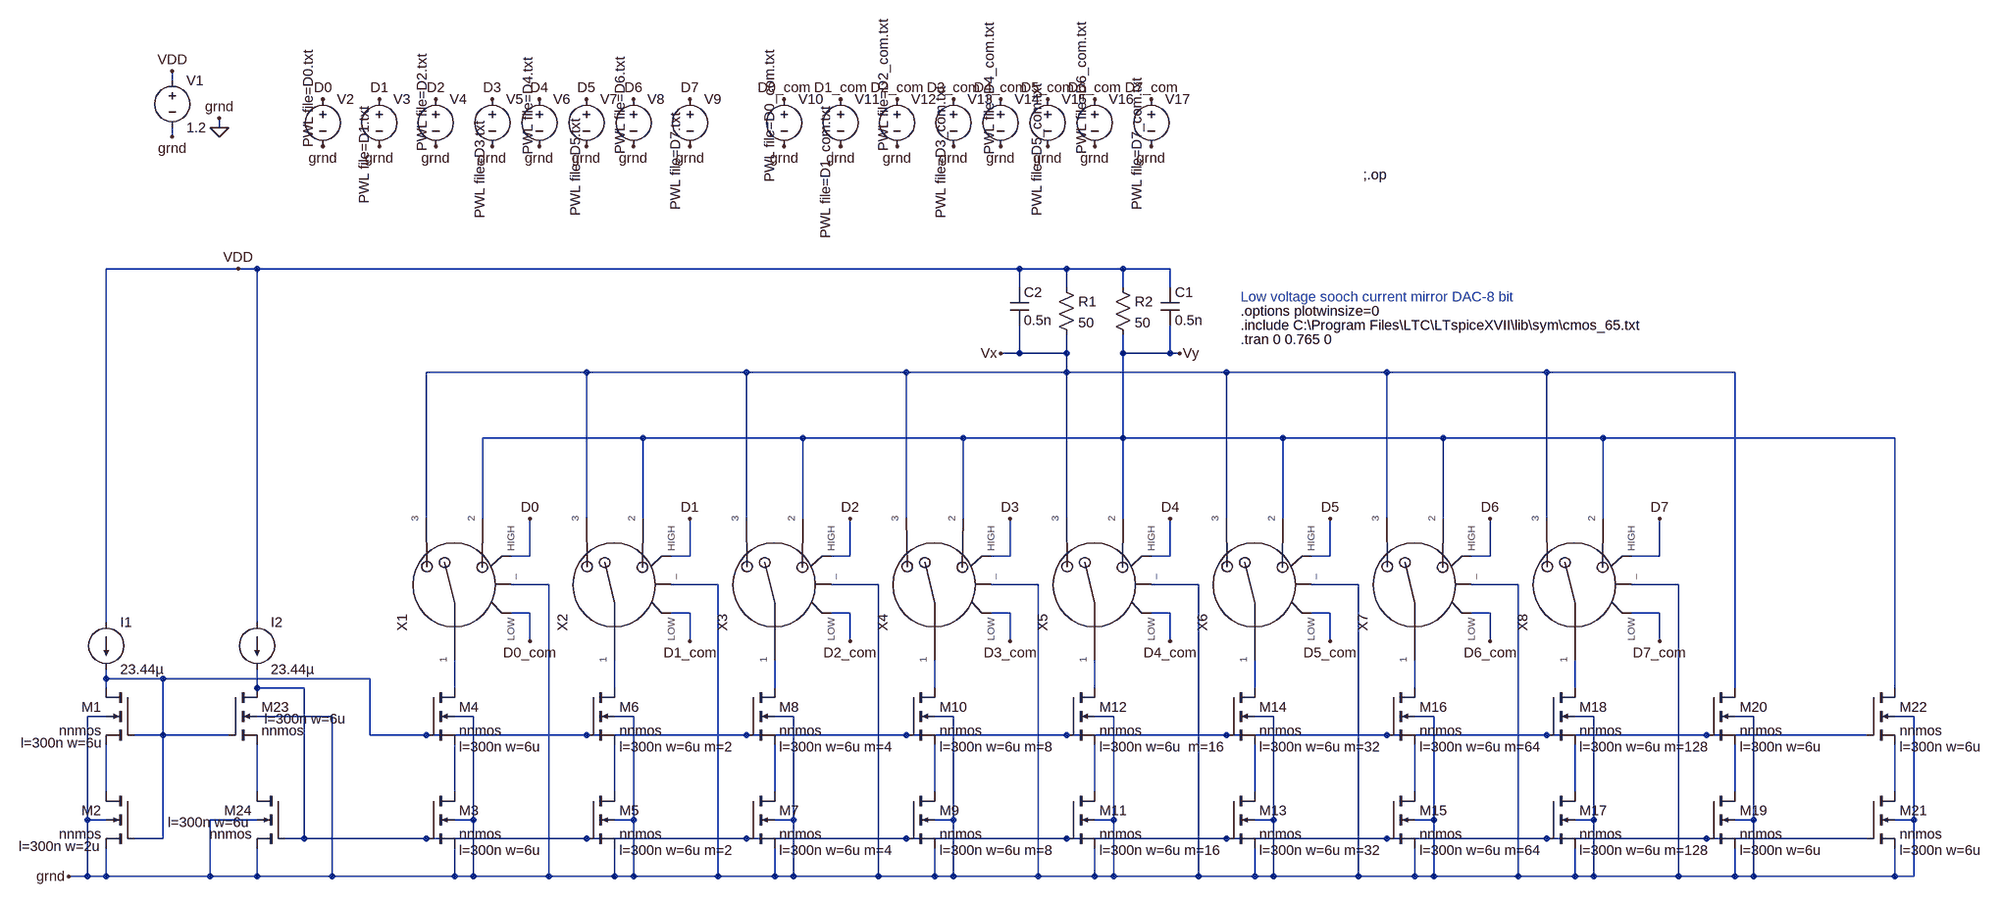
[diagram p0: schematic DAC_lvs.asc]
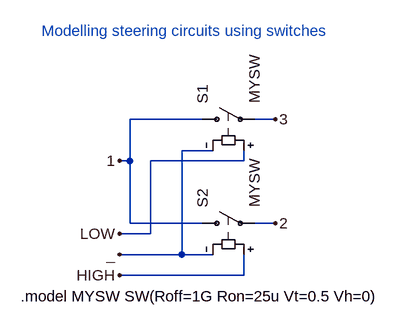
[diagram p1: sub-circuit myspdt.asc]
DAC_lvs.asc, the LTspice schematic file:
Version 4
SHEET 1 1984 1152
WIRE -1680 -336 -1680 -352
WIRE -1600 -256 -1600 -272
WIRE -1680 -240 -1680 -256
WIRE -1568 -16 -1792 -16
WIRE -1536 -16 -1568 -16
WIRE -240 -16 -1536 -16
WIRE -160 -16 -240 -16
WIRE -64 -16 -160 -16
WIRE 16 -16 -64 -16
WIRE -240 16 -240 -16
WIRE -160 16 -160 -16
WIRE -64 16 -64 -16
WIRE 16 16 16 -16
WIRE -240 128 -240 80
WIRE -240 128 -272 128
WIRE -160 128 -160 96
WIRE -160 128 -240 128
WIRE -64 128 -64 96
WIRE 16 128 16 80
WIRE 16 128 -64 128
WIRE 32 128 16 128
WIRE -976 160 -1248 160
WIRE -704 160 -976 160
WIRE -432 160 -704 160
WIRE -160 160 -160 128
WIRE -160 160 -432 160
WIRE 112 160 -160 160
WIRE 384 160 112 160
WIRE 656 160 384 160
WIRE 976 160 656 160
WIRE -880 272 -1152 272
WIRE -608 272 -880 272
WIRE -336 272 -608 272
WIRE -64 272 -64 128
WIRE -64 272 -336 272
WIRE 208 272 -64 272
WIRE 480 272 208 272
WIRE 752 272 480 272
WIRE 1248 272 752 272
WIRE -1248 464 -1248 160
WIRE -1152 464 -1152 272
WIRE -976 464 -976 160
WIRE -880 464 -880 272
WIRE -704 464 -704 160
WIRE -608 464 -608 272
WIRE -432 464 -432 160
WIRE -336 464 -336 272
WIRE -160 464 -160 160
WIRE -64 464 -64 272
WIRE 112 464 112 160
WIRE 208 464 208 272
WIRE 384 464 384 160
WIRE 480 464 480 272
WIRE 656 464 656 160
WIRE 752 464 752 272
WIRE -1072 528 -1072 464
WIRE -1072 528 -1104 528
WIRE -800 528 -800 464
WIRE -800 528 -832 528
WIRE -528 528 -528 464
WIRE -528 528 -560 528
WIRE -256 528 -256 464
WIRE -256 528 -288 528
WIRE 16 528 16 464
WIRE 16 528 -16 528
WIRE 288 528 288 464
WIRE 288 528 256 528
WIRE 560 528 560 464
WIRE 560 528 528 528
WIRE 848 528 848 464
WIRE 848 528 800 528
WIRE -1040 576 -1104 576
WIRE -752 576 -832 576
WIRE -480 576 -560 576
WIRE -208 576 -288 576
WIRE 64 576 -16 576
WIRE 336 576 256 576
WIRE 608 576 528 576
WIRE 880 576 800 576
WIRE -1072 624 -1104 624
WIRE -800 624 -832 624
WIRE -528 624 -560 624
WIRE -256 624 -288 624
WIRE 16 624 -16 624
WIRE 288 624 256 624
WIRE 560 624 528 624
WIRE 848 624 800 624
WIRE -1792 640 -1792 -16
WIRE -1536 640 -1536 -16
WIRE -1072 672 -1072 624
WIRE -800 672 -800 624
WIRE -528 672 -528 624
WIRE -256 672 -256 624
WIRE 16 672 16 624
WIRE 288 672 288 624
WIRE 560 672 560 624
WIRE 848 672 848 624
WIRE -1792 736 -1792 720
WIRE -1696 736 -1792 736
WIRE -1344 736 -1696 736
WIRE -1792 752 -1792 736
WIRE -1536 752 -1536 720
WIRE -1456 752 -1536 752
WIRE -1200 752 -1200 704
WIRE -928 752 -928 704
WIRE -656 752 -656 704
WIRE -384 752 -384 704
WIRE -112 752 -112 704
WIRE 160 752 160 704
WIRE 432 752 432 704
WIRE 704 752 704 704
WIRE 976 752 976 160
WIRE 1248 752 1248 272
WIRE -1792 800 -1824 800
WIRE -1408 800 -1536 800
WIRE -1168 800 -1200 800
WIRE -896 800 -928 800
WIRE -624 800 -656 800
WIRE -352 800 -384 800
WIRE -80 800 -112 800
WIRE 192 800 160 800
WIRE 464 800 432 800
WIRE 736 800 704 800
WIRE 1008 800 976 800
WIRE 1280 800 1248 800
WIRE -1696 832 -1696 736
WIRE -1696 832 -1744 832
WIRE -1584 832 -1696 832
WIRE -1344 832 -1344 736
WIRE -1248 832 -1344 832
WIRE -976 832 -1248 832
WIRE -704 832 -976 832
WIRE -432 832 -704 832
WIRE -160 832 -432 832
WIRE 112 832 -160 832
WIRE 384 832 112 832
WIRE 656 832 384 832
WIRE 928 832 656 832
WIRE 1200 832 928 832
WIRE -1792 928 -1792 848
WIRE -1536 928 -1536 848
WIRE -1200 928 -1200 848
WIRE -928 928 -928 848
WIRE -656 928 -656 848
WIRE -384 928 -384 848
WIRE -112 928 -112 848
WIRE 160 928 160 848
WIRE 432 928 432 848
WIRE 704 928 704 848
WIRE 976 928 976 848
WIRE 1248 928 1248 848
WIRE -1824 976 -1824 800
WIRE -1792 976 -1824 976
WIRE -1536 976 -1616 976
WIRE -1168 976 -1168 800
WIRE -1168 976 -1200 976
WIRE -896 976 -896 800
WIRE -896 976 -928 976
WIRE -624 976 -624 800
WIRE -624 976 -656 976
WIRE -352 976 -352 800
WIRE -352 976 -384 976
WIRE -80 976 -80 800
WIRE -80 976 -112 976
WIRE 192 976 192 800
WIRE 192 976 160 976
WIRE 464 976 464 800
WIRE 464 976 432 976
WIRE 736 976 736 800
WIRE 736 976 704 976
WIRE 1008 976 1008 800
WIRE 1008 976 976 976
WIRE 1280 976 1280 800
WIRE 1280 976 1248 976
WIRE -1696 1008 -1696 832
WIRE -1696 1008 -1744 1008
WIRE -1456 1008 -1456 752
WIRE -1456 1008 -1488 1008
WIRE -1248 1008 -1456 1008
WIRE -976 1008 -1248 1008
WIRE -704 1008 -976 1008
WIRE -432 1008 -704 1008
WIRE -160 1008 -432 1008
WIRE 112 1008 -160 1008
WIRE 384 1008 112 1008
WIRE 656 1008 384 1008
WIRE 928 1008 656 1008
WIRE 1200 1008 928 1008
WIRE -1824 1072 -1824 976
WIRE -1824 1072 -1856 1072
WIRE -1792 1072 -1792 1024
WIRE -1792 1072 -1824 1072
WIRE -1616 1072 -1616 976
WIRE -1616 1072 -1792 1072
WIRE -1536 1072 -1536 1024
WIRE -1536 1072 -1616 1072
WIRE -1408 1072 -1408 800
WIRE -1408 1072 -1536 1072
WIRE -1200 1072 -1200 1024
WIRE -1200 1072 -1408 1072
WIRE -1168 1072 -1168 976
WIRE -1168 1072 -1200 1072
WIRE -1040 1072 -1040 576
WIRE -1040 1072 -1168 1072
WIRE -928 1072 -928 1024
WIRE -928 1072 -1040 1072
WIRE -896 1072 -896 976
WIRE -896 1072 -928 1072
WIRE -752 1072 -752 576
WIRE -752 1072 -896 1072
WIRE -656 1072 -656 1024
WIRE -656 1072 -752 1072
WIRE -624 1072 -624 976
WIRE -624 1072 -656 1072
WIRE -480 1072 -480 576
WIRE -480 1072 -624 1072
WIRE -384 1072 -384 1024
WIRE -384 1072 -480 1072
WIRE -352 1072 -352 976
WIRE -352 1072 -384 1072
WIRE -208 1072 -208 576
WIRE -208 1072 -352 1072
WIRE -112 1072 -112 1024
WIRE -112 1072 -208 1072
WIRE -80 1072 -80 976
WIRE -80 1072 -112 1072
WIRE 64 1072 64 576
WIRE 64 1072 -80 1072
WIRE 160 1072 160 1024
WIRE 160 1072 64 1072
WIRE 192 1072 192 976
WIRE 192 1072 160 1072
WIRE 336 1072 336 576
WIRE 336 1072 192 1072
WIRE 432 1072 432 1024
WIRE 432 1072 336 1072
WIRE 464 1072 464 976
WIRE 464 1072 432 1072
WIRE 608 1072 608 576
WIRE 608 1072 464 1072
WIRE 704 1072 704 1024
WIRE 704 1072 608 1072
WIRE 736 1072 736 976
WIRE 736 1072 704 1072
WIRE 880 1072 880 576
WIRE 880 1072 736 1072
WIRE 976 1072 976 1024
WIRE 976 1072 880 1072
WIRE 1008 1072 1008 976
WIRE 1008 1072 976 1072
WIRE 1248 1072 1248 1024
WIRE 1248 1072 1008 1072
WIRE 1280 1072 1280 976
WIRE 1280 1072 1248 1072
FLAG -1600 -256 0
FLAG -1600 -272 grnd
FLAG -1680 -240 grnd
FLAG -1680 -352 VDD
FLAG -1568 -16 VDD
FLAG -272 128 Vx
FLAG 32 128 Vy
FLAG -1856 1072 grnd
FLAG -1424 -224 grnd
FLAG -1328 -224 grnd
FLAG -1232 -224 grnd
FLAG -1136 -224 grnd
FLAG -1056 -224 grnd
FLAG -976 -224 grnd
FLAG -896 -224 grnd
FLAG -800 -224 grnd
FLAG -1424 -304 D0
FLAG -1328 -304 D1
FLAG -1232 -304 D2
FLAG -1136 -304 D3
FLAG -1056 -304 D4
FLAG -976 -304 D5
FLAG -896 -304 D6
FLAG -800 -304 D7
FLAG -640 -224 grnd
FLAG -544 -224 grnd
FLAG -448 -224 grnd
FLAG -352 -224 grnd
FLAG -272 -224 grnd
FLAG -192 -224 grnd
FLAG -112 -224 grnd
FLAG -16 -224 grnd
FLAG -640 -304 D0_com
FLAG -544 -304 D1_com
FLAG -448 -304 D2_com
FLAG -352 -304 D3_com
FLAG -272 -304 D4_com
FLAG -192 -304 D5_com
FLAG -112 -304 D6_com
FLAG -1072 464 D0
FLAG -800 464 D1
FLAG -528 464 D2
FLAG -256 464 D3
FLAG 288 464 D5
FLAG 16 464 D4
FLAG 560 464 D6
FLAG 848 464 D7
FLAG -1072 672 D0_com
FLAG -800 672 D1_com
FLAG -528 672 D2_com
FLAG -256 672 D3_com
FLAG 16 672 D4_com
FLAG 288 672 D5_com
FLAG 560 672 D6_com
FLAG -16 -304 D7_com
FLAG 848 672 D7_com
DATAFLAG -1200 736 ""
DATAFLAG -1200 896 ""
DATAFLAG -928 864 ""
DATAFLAG -656 880 ""
SYMBOL nmos4 -1248 928 R0
WINDOW 123 56 100 Left 2
SYMATTR Value2 l=300n w=6u
SYMATTR InstName M3
SYMATTR Value nnmos
SYMBOL nmos4 -1248 752 R0
WINDOW 123 56 100 Left 2
SYMATTR Value2 l=300n w=6u
SYMATTR InstName M4
SYMATTR Value nnmos
SYMBOL voltage -1680 -352 R0
WINDOW 123 0 0 Left 0
WINDOW 39 0 0 Left 0
SYMATTR InstName V1
SYMATTR Value 1.2
SYMBOL nmos4 -976 928 R0
WINDOW 123 56 100 Left 2
SYMATTR Value2 l=300n w=6u m=2
SYMATTR InstName M5
SYMATTR Value nnmos
SYMBOL nmos4 -976 752 R0
WINDOW 123 56 100 Left 2
SYMATTR Value2 l=300n w=6u m=2
SYMATTR InstName M6
SYMATTR Value nnmos
SYMBOL nmos4 -704 928 R0
WINDOW 123 56 100 Left 2
SYMATTR Value2 l=300n w=6u m=4
SYMATTR InstName M7
SYMATTR Value nnmos
SYMBOL nmos4 -704 752 R0
WINDOW 123 56 100 Left 2
SYMATTR Value2 l=300n w=6u m=4
SYMATTR InstName M8
SYMATTR Value nnmos
SYMBOL nmos4 -432 928 R0
WINDOW 123 56 100 Left 2
SYMATTR Value2 l=300n w=6u m=8
SYMATTR InstName M9
SYMATTR Value nnmos
SYMBOL nmos4 -432 752 R0
WINDOW 123 56 100 Left 2
SYMATTR Value2 l=300n w=6u m=8
SYMATTR InstName M10
SYMATTR Value nnmos
SYMBOL nmos4 -160 928 R0
WINDOW 123 56 100 Left 2
SYMATTR Value2 l=300n w=6u m=16
SYMATTR InstName M11
SYMATTR Value nnmos
SYMBOL nmos4 -160 752 R0
WINDOW 123 56 100 Left 2
SYMATTR Value2 l=300n w=6u  m=16
SYMATTR InstName M12
SYMATTR Value nnmos
SYMBOL nmos4 112 928 R0
WINDOW 123 56 100 Left 2
SYMATTR Value2 l=300n w=6u m=32
SYMATTR InstName M13
SYMATTR Value nnmos
SYMBOL nmos4 112 752 R0
WINDOW 123 56 100 Left 2
SYMATTR Value2 l=300n w=6u m=32
SYMATTR InstName M14
SYMATTR Value nnmos
SYMBOL nmos4 384 928 R0
WINDOW 123 56 100 Left 2
SYMATTR Value2 l=300n w=6u m=64
SYMATTR InstName M15
SYMATTR Value nnmos
SYMBOL nmos4 384 752 R0
WINDOW 123 56 100 Left 2
SYMATTR Value2 l=300n w=6u m=64
SYMATTR InstName M16
SYMATTR Value nnmos
SYMBOL nmos4 656 928 R0
WINDOW 123 56 100 Left 2
SYMATTR Value2 l=300n w=6u m=128
SYMATTR InstName M17
SYMATTR Value nnmos
SYMBOL nmos4 656 752 R0
WINDOW 123 56 100 Left 2
SYMATTR Value2 l=300n w=6u m=128
SYMATTR InstName M18
SYMATTR Value nnmos
SYMBOL nmos4 928 928 R0
WINDOW 123 56 100 Left 2
SYMATTR Value2 l=300n w=6u
SYMATTR InstName M19
SYMATTR Value nnmos
SYMBOL nmos4 928 752 R0
WINDOW 123 56 100 Left 2
SYMATTR Value2 l=300n w=6u
SYMATTR InstName M20
SYMATTR Value nnmos
SYMBOL nmos4 1200 928 R0
WINDOW 123 56 100 Left 2
SYMATTR Value2 l=300n w=6u
SYMATTR InstName M21
SYMATTR Value nnmos
SYMBOL nmos4 1200 752 R0
WINDOW 123 56 100 Left 2
SYMATTR Value2 l=300n w=6u
SYMATTR InstName M22
SYMATTR Value nnmos
SYMBOL myspdt -1200 608 R270
SYMATTR InstName X1
SYMBOL myspdt -928 608 R270
SYMATTR InstName X2
SYMBOL myspdt -656 608 R270
SYMATTR InstName X3
SYMBOL myspdt -384 608 R270
SYMATTR InstName X4
SYMBOL myspdt -112 608 R270
SYMATTR InstName X5
SYMBOL myspdt 160 608 R270
SYMATTR InstName X6
SYMBOL myspdt 432 608 R270
SYMATTR InstName X7
SYMBOL myspdt 704 608 R270
SYMATTR InstName X8
SYMBOL res -176 0 R0
SYMATTR InstName R1
SYMATTR Value 50
SYMBOL res -80 0 R0
SYMATTR InstName R2
SYMATTR Value 50
SYMBOL nmos4 -1744 752 M0
WINDOW 123 55 93 Left 2
SYMATTR Value2 l=300n w=6u
SYMATTR InstName M1
SYMATTR Value nnmos
SYMBOL nmos4 -1744 928 M0
WINDOW 123 58 93 Left 2
SYMATTR Value2 l=300n w=2u
SYMATTR InstName M2
SYMATTR Value nnmos
SYMBOL nmos4 -1584 752 R0
WINDOW 123 61 52 Left 2
SYMATTR Value2 l=300n w=6u
SYMATTR InstName M23
SYMATTR Value nnmos
SYMBOL nmos4 -1488 928 M0
WINDOW 123 61 52 Left 2
SYMATTR Value2 l=300n w=6u
SYMATTR InstName M24
SYMATTR Value nnmos
SYMBOL current -1792 640 R0
WINDOW 123 0 0 Left 0
WINDOW 39 0 0 Left 0
SYMATTR InstName I1
SYMATTR Value 23.44µ
SYMBOL current -1536 640 R0
WINDOW 123 0 0 Left 0
WINDOW 39 0 0 Left 0
SYMATTR InstName I2
SYMATTR Value 23.44µ
SYMBOL voltage -1424 -320 R0
WINDOW 3 -24 -68 VRight 2
WINDOW 123 0 0 Left 0
WINDOW 39 0 0 Left 0
SYMATTR Value PWL file=D0.txt
SYMATTR InstName V2
SYMBOL voltage -1328 -320 R0
WINDOW 3 -25 28 VRight 2
WINDOW 123 0 0 Left 0
WINDOW 39 0 0 Left 0
SYMATTR Value PWL file=D1.txt
SYMATTR InstName V3
SYMBOL voltage -1232 -320 R0
WINDOW 3 -23 105 VLeft 2
WINDOW 123 0 0 Left 0
WINDOW 39 0 0 Left 0
SYMATTR Value PWL file=D2.txt
SYMATTR InstName V4
SYMBOL voltage -1136 -320 R0
WINDOW 3 -21 219 VLeft 2
WINDOW 123 0 0 Left 0
WINDOW 39 0 0 Left 0
SYMATTR Value PWL file=D3.txt
SYMATTR InstName V5
SYMBOL voltage -1056 -320 R0
WINDOW 3 -19 111 VLeft 2
WINDOW 123 0 0 Left 0
WINDOW 39 0 0 Left 0
SYMATTR Value PWL file=D4.txt
SYMATTR InstName V6
SYMBOL voltage -976 -320 R0
WINDOW 3 -18 215 VLeft 2
WINDOW 123 0 0 Left 0
WINDOW 39 0 0 Left 0
SYMATTR Value PWL file=D5.txt
SYMATTR InstName V7
SYMBOL voltage -896 -320 R0
WINDOW 3 -22 110 VLeft 2
WINDOW 123 0 0 Left 0
WINDOW 39 0 0 Left 0
SYMATTR Value PWL file=D6.txt
SYMATTR InstName V8
SYMBOL voltage -800 -320 R0
WINDOW 3 -24 205 VLeft 2
WINDOW 123 0 0 Left 0
WINDOW 39 0 0 Left 0
SYMATTR Value PWL file=D7.txt
SYMATTR InstName V9
SYMBOL voltage -640 -320 R0
WINDOW 3 -24 -68 VRight 2
WINDOW 123 0 0 Left 0
WINDOW 39 0 0 Left 0
SYMATTR Value PWL file=D0_com.txt
SYMATTR InstName V10
SYMBOL voltage -544 -320 R0
WINDOW 3 -25 28 VRight 2
WINDOW 123 0 0 Left 0
WINDOW 39 0 0 Left 0
SYMATTR Value PWL file=D1_com.txt
SYMATTR InstName V11
SYMBOL voltage -448 -320 R0
WINDOW 3 -23 105 VLeft 2
WINDOW 123 0 0 Left 0
WINDOW 39 0 0 Left 0
SYMATTR Value PWL file=D2_com.txt
SYMATTR InstName V12
SYMBOL voltage -352 -320 R0
WINDOW 3 -21 219 VLeft 2
WINDOW 123 0 0 Left 0
WINDOW 39 0 0 Left 0
SYMATTR Value PWL file=D3_com.txt
SYMATTR InstName V13
SYMBOL voltage -272 -320 R0
WINDOW 3 -19 111 VLeft 2
WINDOW 123 0 0 Left 0
WINDOW 39 0 0 Left 0
SYMATTR Value PWL file=D4_com.txt
SYMATTR InstName V14
SYMBOL voltage -192 -320 R0
WINDOW 3 -18 215 VLeft 2
WINDOW 123 0 0 Left 0
WINDOW 39 0 0 Left 0
SYMATTR Value PWL file=D5_com.txt
SYMATTR InstName V15
SYMBOL voltage -112 -320 R0
WINDOW 3 -22 110 VLeft 2
WINDOW 123 0 0 Left 0
WINDOW 39 0 0 Left 0
SYMATTR Value PWL file=D6_com.txt
SYMATTR InstName V16
SYMBOL voltage -16 -320 R0
WINDOW 3 -24 205 VLeft 2
WINDOW 123 0 0 Left 0
WINDOW 39 0 0 Left 0
SYMATTR Value PWL file=D7_com.txt
SYMATTR InstName V17
SYMBOL cap 0 16 R0
SYMATTR InstName C1
SYMATTR Value 0.5n
SYMBOL cap -256 16 R0
SYMATTR InstName C2
SYMATTR Value 0.5n
TEXT 136 32 Left 2 ;Low voltage sooch current mirror DAC-8 bit
TEXT 136 80 Left 2 !.include C:\\Program Files\\LTC\\LTspiceXVII\\lib\\sym\\cmos_65.txt
TEXT 136 56 Left 2 !.options plotwinsize=0
TEXT 136 104 Left 2 !.tran 0 0.765 0
TEXT 344 -176 Left 2 !;.op

myspdt.asc, the sub-circuit schematic file:
Version 4
SHEET 1 880 680
WIRE 144 112 32 112
WIRE 256 112 224 112
WIRE 160 160 112 160
WIRE 32 176 32 112
WIRE 32 176 16 176
WIRE 208 176 208 160
WIRE 208 176 64 176
WIRE 32 272 32 176
WIRE 144 272 32 272
WIRE 256 272 224 272
WIRE 64 288 64 176
WIRE 64 288 16 288
WIRE 112 320 112 160
WIRE 112 320 16 320
WIRE 160 320 112 320
WIRE 208 352 208 320
WIRE 208 352 16 352
FLAG 16 176 1
FLAG 16 352 HIGH
FLAG 16 320 _
FLAG 256 272 2
FLAG 256 112 3
FLAG 16 288 LOW
SYMBOL sw 128 112 R270
SYMATTR InstName S1
SYMATTR Value MYSW
SYMBOL sw 128 272 R270
SYMATTR InstName S2
SYMATTR Value MYSW
TEXT -136 384 Left 2 !.model MYSW SW(Roff=1G Ron=25u Vt=0.5 Vh=0)
TEXT -104 -24 Left 2 ;Modelling steering circuits using switches

The netlist it stands for:
* DAC_lvs.asc
M3 N013 N002 0 0 nnmos l=300n w=6u
M4 N003 N001 N013 0 nnmos l=300n w=6u
V1 VDD 0 1.2
M5 N014 N002 0 0 nnmos l=300n w=6u m=2
M6 N004 N001 N014 0 nnmos l=300n w=6u m=2
M7 N015 N002 0 0 nnmos l=300n w=6u m=4
M8 N005 N001 N015 0 nnmos l=300n w=6u m=4
M9 N016 N002 0 0 nnmos l=300n w=6u m=8
M10 N006 N001 N016 0 nnmos l=300n w=6u m=8
M11 N017 N002 0 0 nnmos l=300n w=6u m=16
M12 N007 N001 N017 0 nnmos l=300n w=6u  m=16
M13 N018 N002 0 0 nnmos l=300n w=6u m=32
M14 N008 N001 N018 0 nnmos l=300n w=6u m=32
M15 N019 N002 0 0 nnmos l=300n w=6u m=64
M16 N009 N001 N019 0 nnmos l=300n w=6u m=64
M17 N020 N002 0 0 nnmos l=300n w=6u m=128
M18 N010 N001 N020 0 nnmos l=300n w=6u m=128
M19 N021 N002 0 0 nnmos l=300n w=6u
M20 Vx N001 N021 0 nnmos l=300n w=6u
M21 N022 N002 0 0 nnmos l=300n w=6u
M22 Vy N001 N022 0 nnmos l=300n w=6u
XX1 N003 Vy Vx D0 D0_com 0 myspdt
XX2 N004 Vy Vx D1 D1_com 0 myspdt
XX3 N005 Vy Vx D2 D2_com 0 myspdt
XX4 N006 Vy Vx D3 D3_com 0 myspdt
XX5 N007 Vy Vx D4 D4_com 0 myspdt
XX6 N008 Vy Vx D5 D5_com 0 myspdt
XX7 N009 Vy Vx D6 D6_com 0 myspdt
XX8 N010 Vy Vx D7 D7_com 0 myspdt
R1 VDD Vx 50
R2 VDD Vy 50
M1 N001 N001 N011 0 nnmos l=300n w=6u
M2 N011 N001 0 0 nnmos l=300n w=2u
M23 N002 N001 N012 0 nnmos l=300n w=6u
M24 N012 N002 0 0 nnmos l=300n w=6u
I1 VDD N001 23.44µ
I2 VDD N002 23.44µ
V2 D0 0 PWL file=D0.txt
V3 D1 0 PWL file=D1.txt
V4 D2 0 PWL file=D2.txt
V5 D3 0 PWL file=D3.txt
V6 D4 0 PWL file=D4.txt
V7 D5 0 PWL file=D5.txt
V8 D6 0 PWL file=D6.txt
V9 D7 0 PWL file=D7.txt
V10 D0_com 0 PWL file=D0_com.txt
V11 D1_com 0 PWL file=D1_com.txt
V12 D2_com 0 PWL file=D2_com.txt
V13 D3_com 0 PWL file=D3_com.txt
V14 D4_com 0 PWL file=D4_com.txt
V15 D5_com 0 PWL file=D5_com.txt
V16 D6_com 0 PWL file=D6_com.txt
V17 D7_com 0 PWL file=D7_com.txt
C1 VDD Vy 0.5n
C2 VDD Vx 0.5n

* block symbol definitions
.subckt myspdt 1 2 3 HIGH LOW _
S1 1 3 LOW _ MYSW
S2 1 2 HIGH _ MYSW
.model MYSW SW(Roff=1G Ron=25u Vt=0.5 Vh=0)
* Modelling steering circuits using switches
.ends myspdt

.model NMOS NMOS
.model PMOS PMOS
.lib standard.mos
* Low voltage sooch current mirror DAC-8 bit
.include C:\Program Files\LTC\LTspiceXVII\lib\sym\cmos_65.txt
.options plotwinsize=0
.tran 0 0.765 0
;.op
.backanno
.end